# Altium schematic sheet Sch_pwr.SchDoc
size A
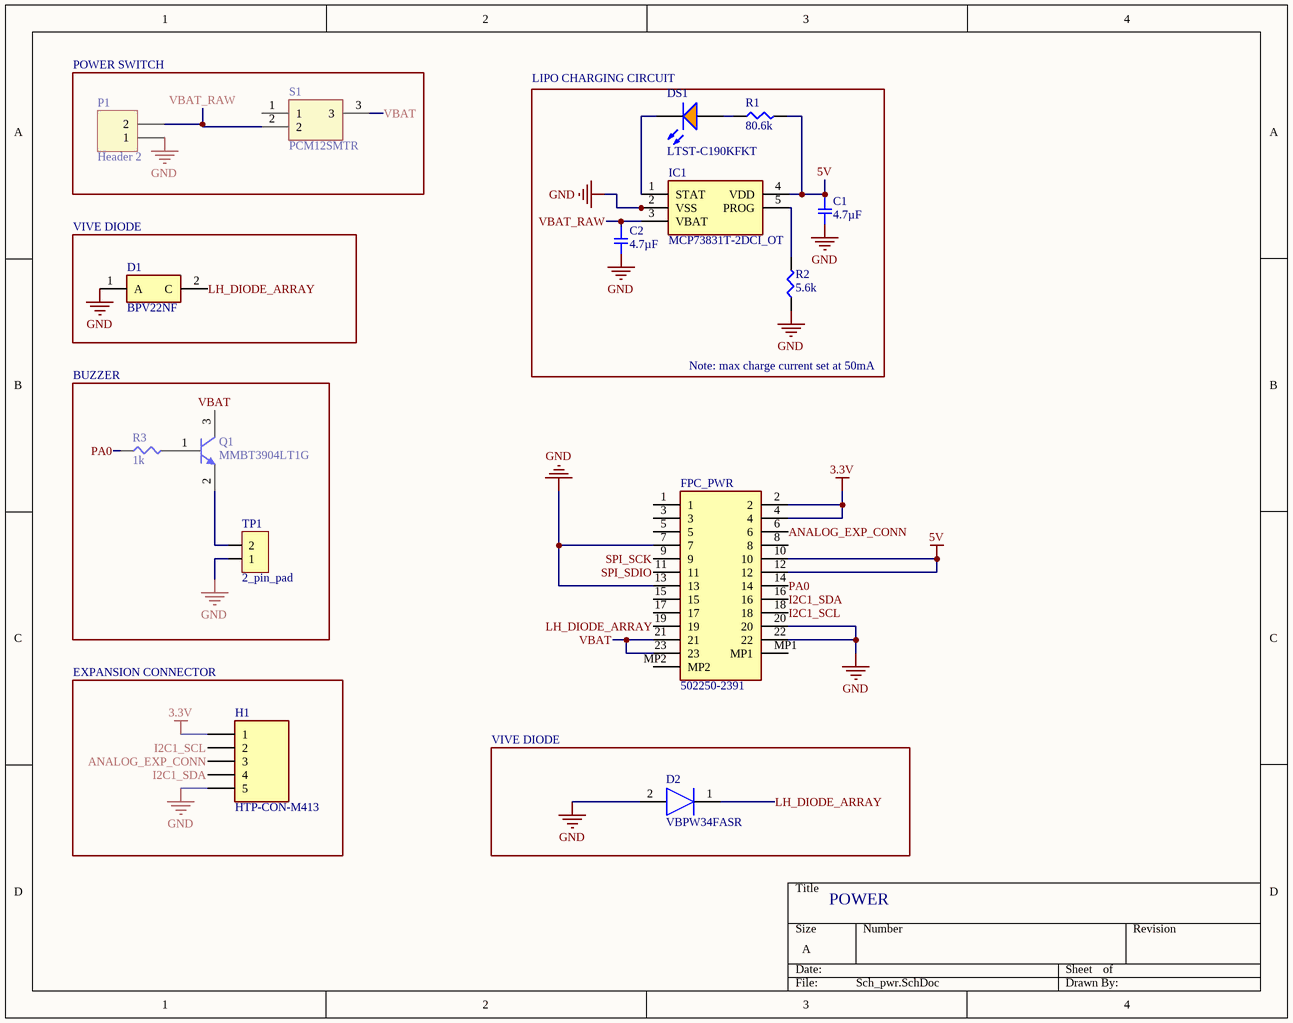
[diagram p0: Sch_pwr.SchDoc]

## Parts
C1  4.7µF  [SMD-0402C]
C2  4.7µF  [SMD-0402C]
D1  BPV22NF  [TO254P510X450X920-2P]
D2  VBPW34FASR  [VBPW34FASR]
DS1  LTST-C190KFKT  [LTST-C190KFKT_V]
FPC_PWR  502250-2391  [5022502391]
H1  HTP-CON-M413  [HTP-CON-M413]
IC1  MCP73831T-2DCI_OT  [SOT95P270X145-5N]
P1  Header 2  [HDR1X2]
Q1  MMBT3904LT1G  [ONSC-SOT-23-3-318-08_V]
R1  80.6k  [SMD-0402-RES]
R2  5.6k  [SMD-0402-RES]
R3  1k  [SMD-0402-RES]
S1  PCM12SMTR  [PCM12SMTR_1]
TP1  2_pin_pad  [Edge Connector (2-mini)]

## Blocks framed on the sheet
POWER SWITCH: P1 S1
VIVE DIODE: D1
BUZZER: Q1 R3 TP1
EXPANSION CONNECTOR: H1
VIVE DIODE: D2

## Nets
3.3V: FPC_PWR.2 FPC_PWR.4 H1.1
5V: C1.1 FPC_PWR.10 FPC_PWR.12 IC1.4(VDD) R1.2
GND: C1.2 C2.2 D1.1(A) D2.2(K) FPC_PWR.7 FPC_PWR.13 FPC_PWR.20 FPC_PWR.22 H1.5 IC1.2(VSS) P1.1 R2.1 TP1.1
ANALOG_EXP_CONN: FPC_PWR.6 H1.3
I2C1_SCL: FPC_PWR.18 H1.2
I2C1_SDA: FPC_PWR.16 H1.4
LH_DIODE_ARRAY: D1.2(C) D2.1(A) FPC_PWR.19
PA0: FPC_PWR.14 R3.1
SPI_SCK: FPC_PWR.9
SPI_SDIO: FPC_PWR.11
VBAT: FPC_PWR.21 FPC_PWR.23 Q1.3(C) S1.3
VBAT_RAW: C2.1 IC1.3(VBAT) P1.2 S1.2
NetDS1_1: DS1.1(A) R1.1
NetDS1_2: DS1.2(K) IC1.1(STAT)
NetIC1_5: IC1.5(PROG) R2.2
NetQ1_1: Q1.1(B) R3.2
NetQ1_2: Q1.2(E) TP1.2

Not connected (* = marked no-connect by the designer): FPC_PWR 1 3 5 8 15 17 MP1 MP2; S1 1

## Notes on the sheet
- (near DS1) LIPO CHARGING CIRCUIT
- Note: max charge current set at 50mA
- POWER

## Library data of the parts
C1 C2 = GRM153R60G475ME15D: CAP CER 4.7UF 4V X5R 0402; Manufacturer: Murata Electronics North America; Factory Stock: 0; Unit Price (USD): 0.27; Minimum Quantity: 1; Tolerance: ±20%; Datasheets: http://psearch.en.murata.com/capacitor/product/GRM153R60G475ME15%23.pdf; Image: //media.digikey.com/Renders/Murata%20Renders/ZRB-SERIES-0402.jpg; Digi-Key Part Number: 490-13231-1-ND; Part Number: GRM153R60G475ME15D; Quantity Available: 9100; @ qty: 0; Packaging: Cut Tape (CT); Series: GRM; Part Status: Active; Value: 4.7µF; Voltage: 4V; Temperature Coefficient: X5R; Operating Temperature: -55°C ~ 85°C; Features: -; Ratings: -; Applications: General Purpose; Mounting Type: Surface Mount, MLCC; Package / Case: 0402 (1005 Metric); Size / Dimension: 0.039" L x 0.020" W (1.00mm x 0.50mm); Height - Seated (Max): -; Thickness (Max): 0.013" (0.33mm); Lead Spacing: -; Lead Style: -
D1 = BPV22NF: Diode; Manufacturer_Name: Vishay; Allied_Number: R1086877; Datasheet Link: http://www.vishay.com/docs/81509/bpv22nf.pdf; Height: 5.1mm; Manufacturer_Part_Number: BPV22NF; Mouser Part Number: 782-BPV22NF; Mouser Price/Stock: https://www.mouser.com/Search/Refine.aspx?Keyword=782-BPV22NF; RS Part Number: 6997604P; RS Price/Stock: http://uk.rs-online.com/web/p/products/6997604P; Allied Price/Stock: https://www.alliedelec.com/vishay-dale-bpv22nf/R1086877/
D2 = VBPW34FASR: Diode; Manufacturer_Name: Vishay; Datasheet Link: https://www.vishay.com/docs/81127/vbpw34fa.pdf; Height: 1.3mm; Manufacturer_Part_Number: VBPW34FASR; Mouser Part Number: 782-VBPW34FASR; Mouser Price/Stock: https://www.mouser.com/Search/Refine.aspx?Keyword=782-VBPW34FASR; RS Part Number: 7689401; RS Price/Stock: https://uk.rs-online.com/web/p/products/7689401
DS1 = CMP-1674-00008-1: LED Uni-Color Orange, 75 mW, 30 mA, -35 to 85 degC, 2-Pin SMD, RoHS, Tape and Reel; Resistance: 47 kohm; Power Rating: 100 mW; Case\Package: 0603; Tolerance: 1%; Voltage Rating (DC): 50 V; ComponentLink2URL: http://optoelectronics.liteon.com/upload/download/DS-22-99-0186/S_110_LTST-C190KFKT.pdf; Mount: Surface Mount; Pins: 2; Package Quantity: 5000; Max Operating Temperature: 155 degC; RoHSCompliant: true; PackageDescription: 2-Pin Surface Mount Device, Body 1.6 x 0.8 mm; Case Code (Metric): 1608; PackageReference: C190KFKT; Height: 0.45 mm; ComponentLink2Description: Datasheet; Min Operating Temperature: -55 degC; DatasheetVersion: Rev. I, 09/2011; Packaging: Tape and Reel; ComponentLink1Description: Manufacturer URL; ComponentLink1URL: http://www.us.liteon.com/; Voltage Rating: 50 V; Case Code (Imperial): 0603; Length: 1.6 mm; Width: 0.8 mm; REACH SVHC: No SVHC
FPC_PWR = 502250-2391: Connector; Manufacturer_Name: Molex; Datasheet Link: https://www.molex.com/pdm_docs/sd/5022501791_sd.pdf; Height: 1.85mm; Manufacturer_Part_Number: 502250-2391; Mouser Part Number: 538-502250-2391; Mouser Price/Stock: https://www.mouser.com/Search/Refine.aspx?Keyword=538-502250-2391; System: Connector
IC1 = MCP73831T-2DCI_OT: Integrated Circuit; Manufacturer_Name: Microchip; Manufacturer_Part_Number: MCP73831T-2DCI/OT; Allied_Number: 70414854; Datasheet Link: http://ww1.microchip.com/downloads/en/DeviceDoc/20001984g.pdf; Height: 1.45mm; Mouser Part Number: 579-MCP73831T-2DCIOT; Mouser Price/Stock: https://www.mouser.com/Search/Refine.aspx?Keyword=579-MCP73831T-2DCIOT; RS Part Number: 7240599P; RS Price/Stock: http://uk.rs-online.com/web/p/products/7240599P; Allied Price/Stock: http://www.alliedelec.com/microchip-technology-inc-mcp73831t-2dci-ot/70414854/
P1 = Header 2: Header, 2-Pin; LatestRevisionDate: 17-Jul-2002; LatestRevisionNote: Re-released for DXP Platform.; Publisher: Altium Limited
Q1 = CMP-1048-00631-1: General Purpose Transistor, NPN Silicon, 3-Pin SOT-23, Pb-Free, Tape and Reel; Manufacturer: On Semiconductor; IC Continuous (A): 0.2; fT Min (MHz): 300; ComponentLink2Description: Datasheet; Polarity: NPN; PackageDescription: 3-Pin Small Outline Transistor, Body 2.92 x 1.3 mm, Pitch 0.95 mm; ComponentLink2URL: http://www.onsemi.cn/pub_link/Collateral/MMBT3904LT1-D.PDF; DatasheetVersion: Rev. 12; Mounting Technology: Surface Mount; PartNumber: MMBT3904LT1G; ComponentLink1URL: http://www.onsemi.com/; ComponentLink3Description: Package Specification; ComponentLink1Description: Manufacturer URL; PackageVersion: Rev. AP, 11/2009; PackageReference: SOT-23-3-318-08; Packing: Tape and Reel; ComponentLink3URL: http://www.onsemi.cn/pub_link/Collateral/318-08.PDF; RoHS: TRUE
R1 = ERJ-2RKF8062X: RES SMD 80.6K OHM 1% 1/10W 0402; Manufacturer: Panasonic Electronic Components; Factory Stock: 0; Unit Price (USD): 0.00496; @ qty: 1500; Minimum Quantity: 1; Power (Watts): 0.1W, 1/10W; Temperature Coefficient: ±100ppm/°C; Part Number: ERJ-2RKF8062X; Datasheets: http://industrial.panasonic.com/www-cgi/jvcr13pz.cgi?E+PZ+3+AOA0002+ERJ2RKF8062X+7+WW; Image: //media.digikey.com/Photos/Panasonic%20Photos/ERJ-PA2-Series.jpg; Digi-Key Part Number: P80.6KLCT-ND; Quantity Available: 91747; Packaging: Cut Tape (CT); Series: ERJ; Part Status: Active; Value: 80.6k; Tolerance: ±1%; Composition: Thick Film; Features: Automotive AEC-Q200; Operating Temperature: -55°C ~ 155°C; Package / Case: 0402 (1005 Metric); Supplier Device Package: 0402; Size / Dimension: 0.039" L x 0.020" W (1.00mm x 0.50mm); Height - Seated (Max): 0.016" (0.40mm); Number of Terminations: 2; Failure Rate: -
R2 = ERJ-2GEJ562X: RES SMD 5.6K OHM 5% 1/10W 0402; Manufacturer: Panasonic Electronic Components; Factory Stock: 0; Unit Price (USD): 0.00350; @ qty: 1500; Minimum Quantity: 1; Power (Watts): 0.1W, 1/10W; Temperature Coefficient: ±200ppm/°C; Part Number: ERJ-2GEJ562X; Datasheets: http://industrial.panasonic.com/www-cgi/jvcr13pz.cgi?E+PZ+3+AOA0001+ERJ2GEJ562X+7+WW; Image: //media.digikey.com/Photos/Panasonic%20Photos/ERJ-PA2-Series.jpg; Digi-Key Part Number: P5.6KJCT-ND; Quantity Available: 212112; Packaging: Cut Tape (CT); Series: ERJ; Part Status: Active; Value: 5.6k; Tolerance: ±5%; Composition: Thick Film; Features: Automotive AEC-Q200; Operating Temperature: -55°C ~ 155°C; Package / Case: 0402 (1005 Metric); Supplier Device Package: 0402; Size / Dimension: 0.039" L x 0.020" W (1.00mm x 0.50mm); Height - Seated (Max): 0.016" (0.40mm); Number of Terminations: 2; Failure Rate: -
R3 = ERJ-2GEJ102X: RES SMD 1K OHM 5% 1/10W 0402; Manufacturer: Panasonic Electronic Components; Factory Stock: 0; Unit Price (USD): 0.00350; @ qty: 1500; Minimum Quantity: 1; Power (Watts): 0.1W, 1/10W; Temperature Coefficient: ±200ppm/°C; Part Number: ERJ-2GEJ102X; Datasheets: http://industrial.panasonic.com/www-cgi/jvcr13pz.cgi?E+PZ+3+AOA0001+ERJ2GEJ102X+7+WW; Image: //media.digikey.com/Photos/Panasonic%20Photos/ERJ-PA2-Series.jpg; Digi-Key Part Number: P1.0KJCT-ND; Quantity Available: 1939857; Packaging: Cut Tape (CT); Series: ERJ; Part Status: Active; Value: 1k; Tolerance: ±5%; Composition: Thick Film; Features: Automotive AEC-Q200; Operating Temperature: -55°C ~ 155°C; Package / Case: 0402 (1005 Metric); Supplier Device Package: 0402; Size / Dimension: 0.039" L x 0.020" W (1.00mm x 0.50mm); Height - Seated (Max): 0.016" (0.40mm); Number of Terminations: 2; Failure Rate: -
S1 = PCM12SMTR: Switch; Manufacturer_Name: C & K COMPONENTS; Allied_Number: 70417448; Datasheet Link: http://www.farnell.com/datasheets/1789487.pdf; Manufacturer_Part_Number: PCM12SMTR; Mouser Part Number: 611-PCM12SMTR; Mouser Price/Stock: https://www.mouser.com/Search/Refine.aspx?Keyword=611-PCM12SMTR; RS Part Number: 7931721P; RS Price/Stock: http://uk.rs-online.com/web/p/products/7931721P; Allied Price/Stock: https://www.alliedelec.com/c-k-pcm12smtr/70417448/